# EAGLE schematic SKEMA GAMBAR TEKNIK (EAGLE 9.6.2)
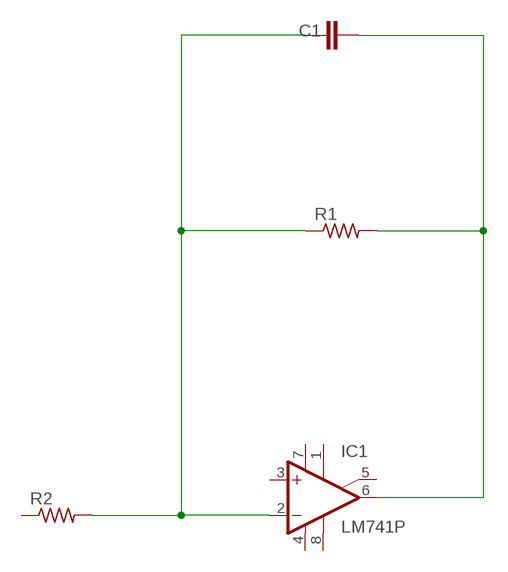
[diagram p0: schematic, sheet 1]

## Parts
C1  C-EUC0603  [C0603]
IC1  LM741P  [DIL08]
R1  R-US_R0603  [R0603]
R2  R-US_R0603  [R0603]

## Nets
N$1: C1.1 IC1.2(-IN) R1.1 R2.2
N$2: C1.2 IC1.6(OUT) R1.2
Unconnected: IC1.1(ON1) IC1.3(+IN) IC1.5(ON2) IC1.8(OPT) R2.1

## Power pins joined to a net without a drawn wire
V+: IC1.7(V+)
V-: IC1.4(V-)

## Library data of the parts
C1 = rcl:C-EU: CAPACITOR, European symbol; SPICEPREFIX: C
IC1 = linear:*741: OP AMP
R1 R2 = rcl:R-US_: RESISTOR, American symbol; SPICEPREFIX: R